# Altium project test project.PrjPcb
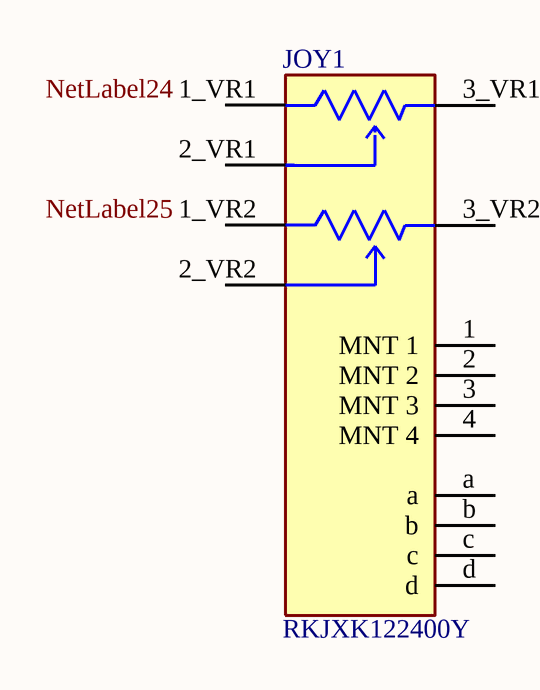
[diagram p0: Sheet1.SchDoc]
1 sheet, 1 parts. Net scope: global (net labels, ports and power ports of the same name join across sheets).

## Sheet Sheet1.SchDoc
size A3; SheetNumber: 1; SheetTotal: 1

### Parts
JOY1  RKJXK122400Y  [FP-RKJXK122400Y-MFG]

### Nets

Not connected (* = marked no-connect by the designer): JOY1 1(MNT_1) 1_VR1(1_VR1) 1_VR2(1_VR2) 2(MNT_2) 2_VR1(2_VR1) 2_VR2(2_VR2) 3(MNT_3) 3_VR1(3_VR1) 3_VR2(3_VR2) 4(MNT_4) a b c d

### Notes on the sheet
- Labels drawn without touching a wire or pin: NetLabel24, NetLabel25

### Library data of the parts
JOY1 = CMP-24118-000005-1: Res POT 10K Ohm 0.0125W (25.4 X 20.7 X 19.3mm) Pin Bracket Mount/Through Hole Tray; Insulation Resistance: 100MR; Resistance: 10kR; Power Rating: 12.5mW; Current Rating: 50mA; Life (Hours): 100Hour; Type: Potentiometer; Mount: Through Hole; Series: RKJXV/ RKJXK; Packaging: Tray; Radiation Hardening: No; Resistor Type: Potentiometer; Termination: Pin; Height: 12.9mm; Military Standard: Not; Min Operating Temperature: -10°C; Max Operating Temperature: 70°C; Package Quantity: 1000; Contact Current Rating: 50mA; Width: 16mm; Depth: 20.7mm; Length: 16mm; RoHS Compliant: Yes